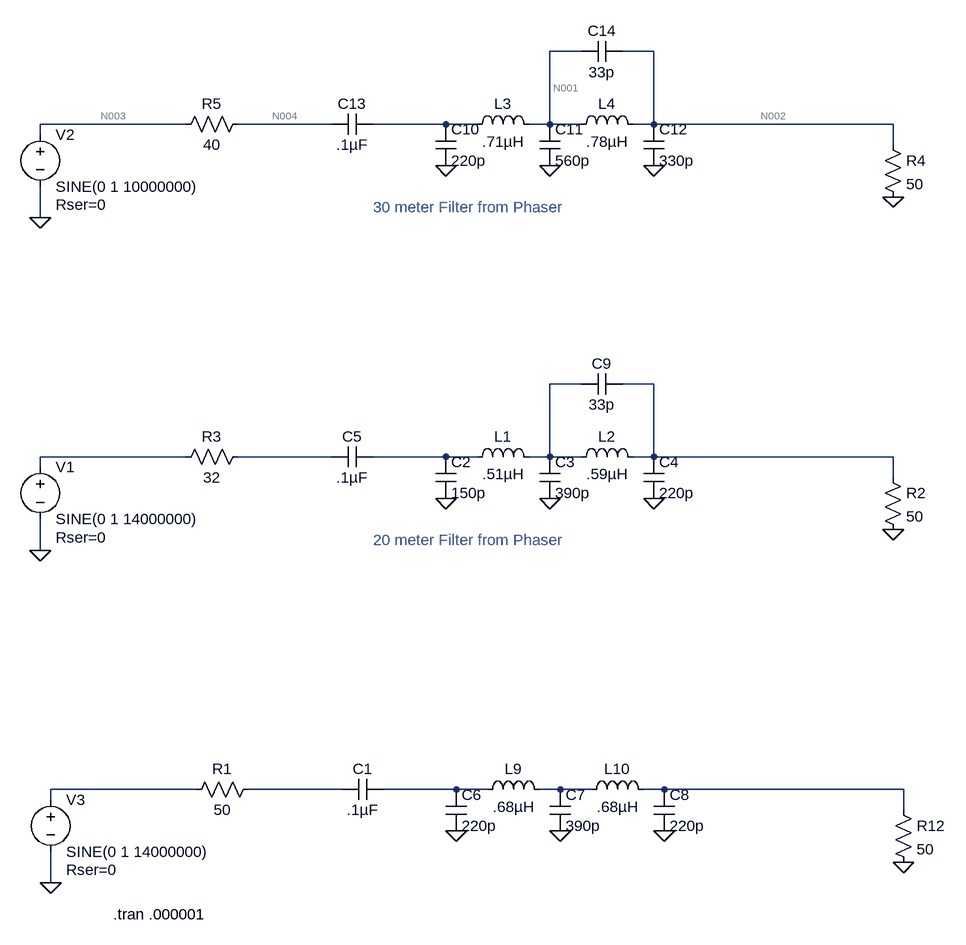
[diagram p0: schematic Phaser Filter.asc]
Phaser Filter.asc, the LTspice schematic file:
Version 4
SHEET 1 3412 1636
WIRE 2848 -336 2800 -336
WIRE 2960 -336 2912 -336
WIRE 2240 -224 2016 -224
WIRE 2464 -224 2320 -224
WIRE 2640 -224 2528 -224
WIRE 2688 -224 2640 -224
WIRE 2800 -224 2800 -336
WIRE 2800 -224 2768 -224
WIRE 2848 -224 2800 -224
WIRE 2960 -224 2960 -336
WIRE 2960 -224 2928 -224
WIRE 3328 -224 2960 -224
WIRE 2016 -208 2016 -224
WIRE 3328 -192 3328 -224
WIRE 2016 -80 2016 -128
WIRE 2848 176 2800 176
WIRE 2960 176 2912 176
WIRE 2240 288 2016 288
WIRE 2464 288 2320 288
WIRE 2640 288 2528 288
WIRE 2688 288 2640 288
WIRE 2800 288 2800 176
WIRE 2800 288 2768 288
WIRE 2848 288 2800 288
WIRE 2960 288 2960 176
WIRE 2960 288 2928 288
WIRE 3328 288 2960 288
WIRE 2016 304 2016 288
WIRE 3328 320 3328 288
WIRE 2016 432 2016 384
WIRE 2256 800 2032 800
WIRE 2480 800 2336 800
WIRE 2656 800 2544 800
WIRE 2704 800 2656 800
WIRE 2816 800 2784 800
WIRE 2864 800 2816 800
WIRE 2976 800 2944 800
WIRE 3344 800 2976 800
WIRE 2032 816 2032 800
WIRE 3344 832 3344 800
WIRE 2032 944 2032 896
FLAG 2032 944 0
FLAG 3344 912 0
FLAG 2656 864 0
FLAG 2816 864 0
FLAG 2976 864 0
FLAG 2016 432 0
FLAG 3328 400 0
FLAG 2640 352 0
FLAG 2800 352 0
FLAG 2960 352 0
FLAG 2016 -80 0
FLAG 3328 -112 0
FLAG 2640 -160 0
FLAG 2800 -160 0
FLAG 2960 -160 0
SYMBOL voltage 2032 800 R0
WINDOW 123 0 0 Left 0
WINDOW 39 24 124 Left 2
SYMATTR SpiceLine Rser=0
SYMATTR InstName V3
SYMATTR Value SINE(0 1 14000000)
SYMBOL res 3328 816 R0
SYMATTR InstName R12
SYMATTR Value 50
SYMBOL cap 2640 800 R0
SYMATTR InstName C6
SYMATTR Value 220p
SYMBOL cap 2800 800 R0
SYMATTR InstName C7
SYMATTR Value 390p
SYMBOL cap 2960 800 R0
SYMATTR InstName C8
SYMATTR Value 220p
SYMBOL ind 2688 816 R270
WINDOW 0 32 56 VTop 2
WINDOW 3 5 56 VBottom 2
SYMATTR InstName L9
SYMATTR Value .68µH
SYMBOL ind 2848 816 R270
WINDOW 0 32 56 VTop 2
WINDOW 3 5 56 VBottom 2
SYMATTR InstName L10
SYMATTR Value .68µH
SYMBOL cap 2544 784 R90
WINDOW 0 0 32 VBottom 2
WINDOW 3 32 32 VTop 2
SYMATTR InstName C1
SYMATTR Value .1µF
SYMBOL res 2352 784 R90
WINDOW 0 0 56 VBottom 2
WINDOW 3 32 56 VTop 2
SYMATTR InstName R1
SYMATTR Value 50
SYMBOL voltage 2016 288 R0
WINDOW 123 0 0 Left 0
WINDOW 39 24 124 Left 2
SYMATTR SpiceLine Rser=0
SYMATTR InstName V1
SYMATTR Value SINE(0 1 14000000)
SYMBOL res 3312 304 R0
SYMATTR InstName R2
SYMATTR Value 50
SYMBOL cap 2624 288 R0
SYMATTR InstName C2
SYMATTR Value 150p
SYMBOL cap 2784 288 R0
SYMATTR InstName C3
SYMATTR Value 390p
SYMBOL cap 2944 288 R0
SYMATTR InstName C4
SYMATTR Value 220p
SYMBOL ind 2672 304 R270
WINDOW 0 32 56 VTop 2
WINDOW 3 5 56 VBottom 2
SYMATTR InstName L1
SYMATTR Value .51µH
SYMBOL ind 2832 304 R270
WINDOW 0 32 56 VTop 2
WINDOW 3 5 56 VBottom 2
SYMATTR InstName L2
SYMATTR Value .59µH
SYMBOL cap 2528 272 R90
WINDOW 0 0 32 VBottom 2
WINDOW 3 32 32 VTop 2
SYMATTR InstName C5
SYMATTR Value .1µF
SYMBOL res 2336 272 R90
WINDOW 0 0 56 VBottom 2
WINDOW 3 32 56 VTop 2
SYMATTR InstName R3
SYMATTR Value 32
SYMBOL cap 2912 160 R90
WINDOW 0 0 32 VBottom 2
WINDOW 3 32 32 VTop 2
SYMATTR InstName C9
SYMATTR Value 33p
SYMBOL voltage 2016 -224 R0
WINDOW 123 0 0 Left 0
WINDOW 39 24 124 Left 2
SYMATTR SpiceLine Rser=0
SYMATTR InstName V2
SYMATTR Value SINE(0 1 10000000)
SYMBOL res 3312 -208 R0
SYMATTR InstName R4
SYMATTR Value 50
SYMBOL cap 2624 -224 R0
SYMATTR InstName C10
SYMATTR Value 220p
SYMBOL cap 2784 -224 R0
SYMATTR InstName C11
SYMATTR Value 560p
SYMBOL cap 2944 -224 R0
SYMATTR InstName C12
SYMATTR Value 330p
SYMBOL ind 2672 -208 R270
WINDOW 0 32 56 VTop 2
WINDOW 3 5 56 VBottom 2
SYMATTR InstName L3
SYMATTR Value .71µH
SYMBOL ind 2832 -208 R270
WINDOW 0 32 56 VTop 2
WINDOW 3 5 56 VBottom 2
SYMATTR InstName L4
SYMATTR Value .78µH
SYMBOL cap 2528 -240 R90
WINDOW 0 0 32 VBottom 2
WINDOW 3 32 32 VTop 2
SYMATTR InstName C13
SYMATTR Value .1µF
SYMBOL res 2336 -240 R90
WINDOW 0 0 56 VBottom 2
WINDOW 3 32 56 VTop 2
SYMATTR InstName R5
SYMATTR Value 40
SYMBOL cap 2912 -352 R90
WINDOW 0 0 32 VBottom 2
WINDOW 3 32 32 VTop 2
SYMATTR InstName C14
SYMATTR Value 33p
TEXT 2128 992 Left 2 !.tran .000001
TEXT 2528 416 Left 2 ;20 meter Filter from Phaser
TEXT 2528 -96 Left 2 ;30 meter Filter from Phaser

The netlist it stands for:
* Phaser Filter.asc
V3 N011 0 SINE(0 1 14000000) Rser=0
R12 N015 0 50
C6 N013 0 220p
C7 N014 0 390p
C8 N015 0 220p
L9 N013 N014 .68µH
L10 N014 N015 .68µH
C1 N013 N012 .1µF
R1 N012 N011 50
V1 N008 0 SINE(0 1 14000000) Rser=0
R2 N007 0 50
C2 N010 0 150p
C3 N006 0 390p
C4 N007 0 220p
L1 N010 N006 .51µH
L2 N006 N007 .59µH
C5 N010 N009 .1µF
R3 N009 N008 32
C9 N007 N006 33p
V2 N003 0 SINE(0 1 10000000) Rser=0
R4 N002 0 50
C10 N005 0 220p
C11 N001 0 560p
C12 N002 0 330p
L3 N005 N001 .71µH
L4 N001 N002 .78µH
C13 N005 N004 .1µF
R5 N004 N003 40
C14 N002 N001 33p
.tran .000001
* 20 meter Filter from Phaser
* 30 meter Filter from Phaser
.backanno
.end

* Results of the author's LTspice run, read from the files saved beside the schematic
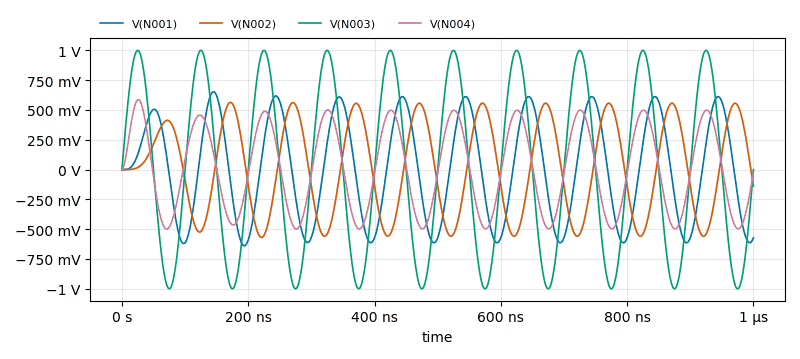
[diagram p1: Transient Analysis of Phaser Filter.asc, plotted from the saved traces]
* Transient Analysis, 1 run:
*   V(N001): min -639 mV, max 653 mV, average 4.375 mV, rms 428.7 mV, last -572.3 mV
*   V(N002): min -569.2 mV, max 563.4 mV, average 16.52 mV, rms 380 mV, last -140 mV
*   V(N003): min -1 V, max 1 V, average 372.7 nV, rms 707.1 mV, last 0 V
*   V(N004): min -498.9 mV, max 586.3 mV, average 1.694 mV, rms 351.4 mV, last -28.69 mV